# Altium schematic sheet MSSch.SchDoc
size A
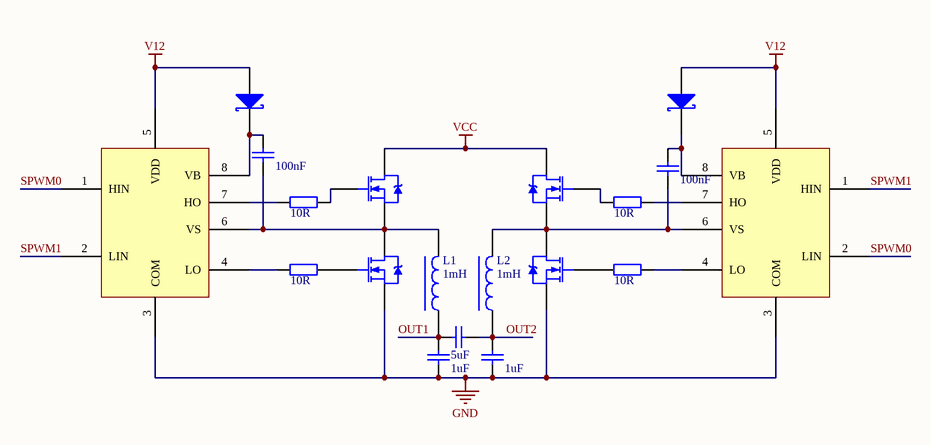
[diagram p0: MSSch.SchDoc]

## Parts
C1  value 100nF  [0603C]  (hidden comment: MLCC)
C2  value 100nF  [0603C]  (hidden comment: MLCC)
C3  value 1uF  [0603C]  (hidden comment: MLCC)
C4  value 1uF  [0603C]  (hidden comment: MLCC)
C5  value 5uF  [0603C]  (hidden comment: MLCC)
D1  SS24  [SMA]  (value not drawn)
D2  SS24  [SMA]  (value not drawn)
L1  value 1mH  [CD32NP]  (hidden comment: PowerInductor)
L2  value 1mH  [CD32NP]  (hidden comment: PowerInductor)
Q1  NMOS  [DPAKUNI]  (value not drawn)
Q2  NMOS  [DPAKUNI]  (value not drawn)
Q3  NMOS  [DPAKUNI]  (value not drawn)
Q4  NMOS  [DPAKUNI]  (value not drawn)
R1  value 10R  [0402R]  (hidden comment: Resistor)
R2  value 10R  [0402R]  (hidden comment: Resistor)
R3  value 10R  [0402R]  (hidden comment: Resistor)
R4  value 10R  [0402R]  (hidden comment: Resistor)
U1  FAN7390  [SO-8_L]  (value not drawn)
U2  FAN7390  [SO-8_L]  (value not drawn)

## Nets
GND: C3.1 C4.1 Q2.3(S) Q4.3(S) U1.3(COM) U2.3(COM)
V12: D1.1(A) D2.1(A) U1.5(VDD) U2.5(VDD)
VCC: Q1.2(D) Q3.2(D)
OUT1: C3.2 C5.2 L1.1
OUT2: C4.2 C5.1 L2.1
SPWM0: U1.1(HIN) U2.2(LIN)
SPWM1: U1.2(LIN) U2.1(HIN)
NetC1_1: C1.1 L1.2 Q1.3(S) Q2.2(D) U1.6(VS)
NetC1_2: C1.2 D1.2(K) U1.8(VB)
NetC2_1: C2.1 L2.2 Q3.3(S) Q4.2(D) U2.6(VS)
NetC2_2: C2.2 D2.2(K) U2.8(VB)
NetQ1_1: Q1.1(G) R1.2
NetQ2_1: Q2.1(G) R2.2
NetQ3_1: Q3.1(G) R3.1
NetQ4_1: Q4.1(G) R4.1
NetR1_1: R1.1 U1.7(HO)
NetR2_1: R2.1 U1.4(LO)
NetR3_2: R3.2 U2.7(HO)
NetR4_2: R4.2 U2.4(LO)

## Library data of the parts
D1 D2 = SS24: Schottky Rectifier
L1 L2 = PowerInductor: Power Inductor
Q1-Q4 = NMOS: N-Channel Power MOSFET
U1 U2 = FAN7390: High & Low side Gate Driver, 4.5A